# Altium schematic sheet Temperature.SchDoc
size B
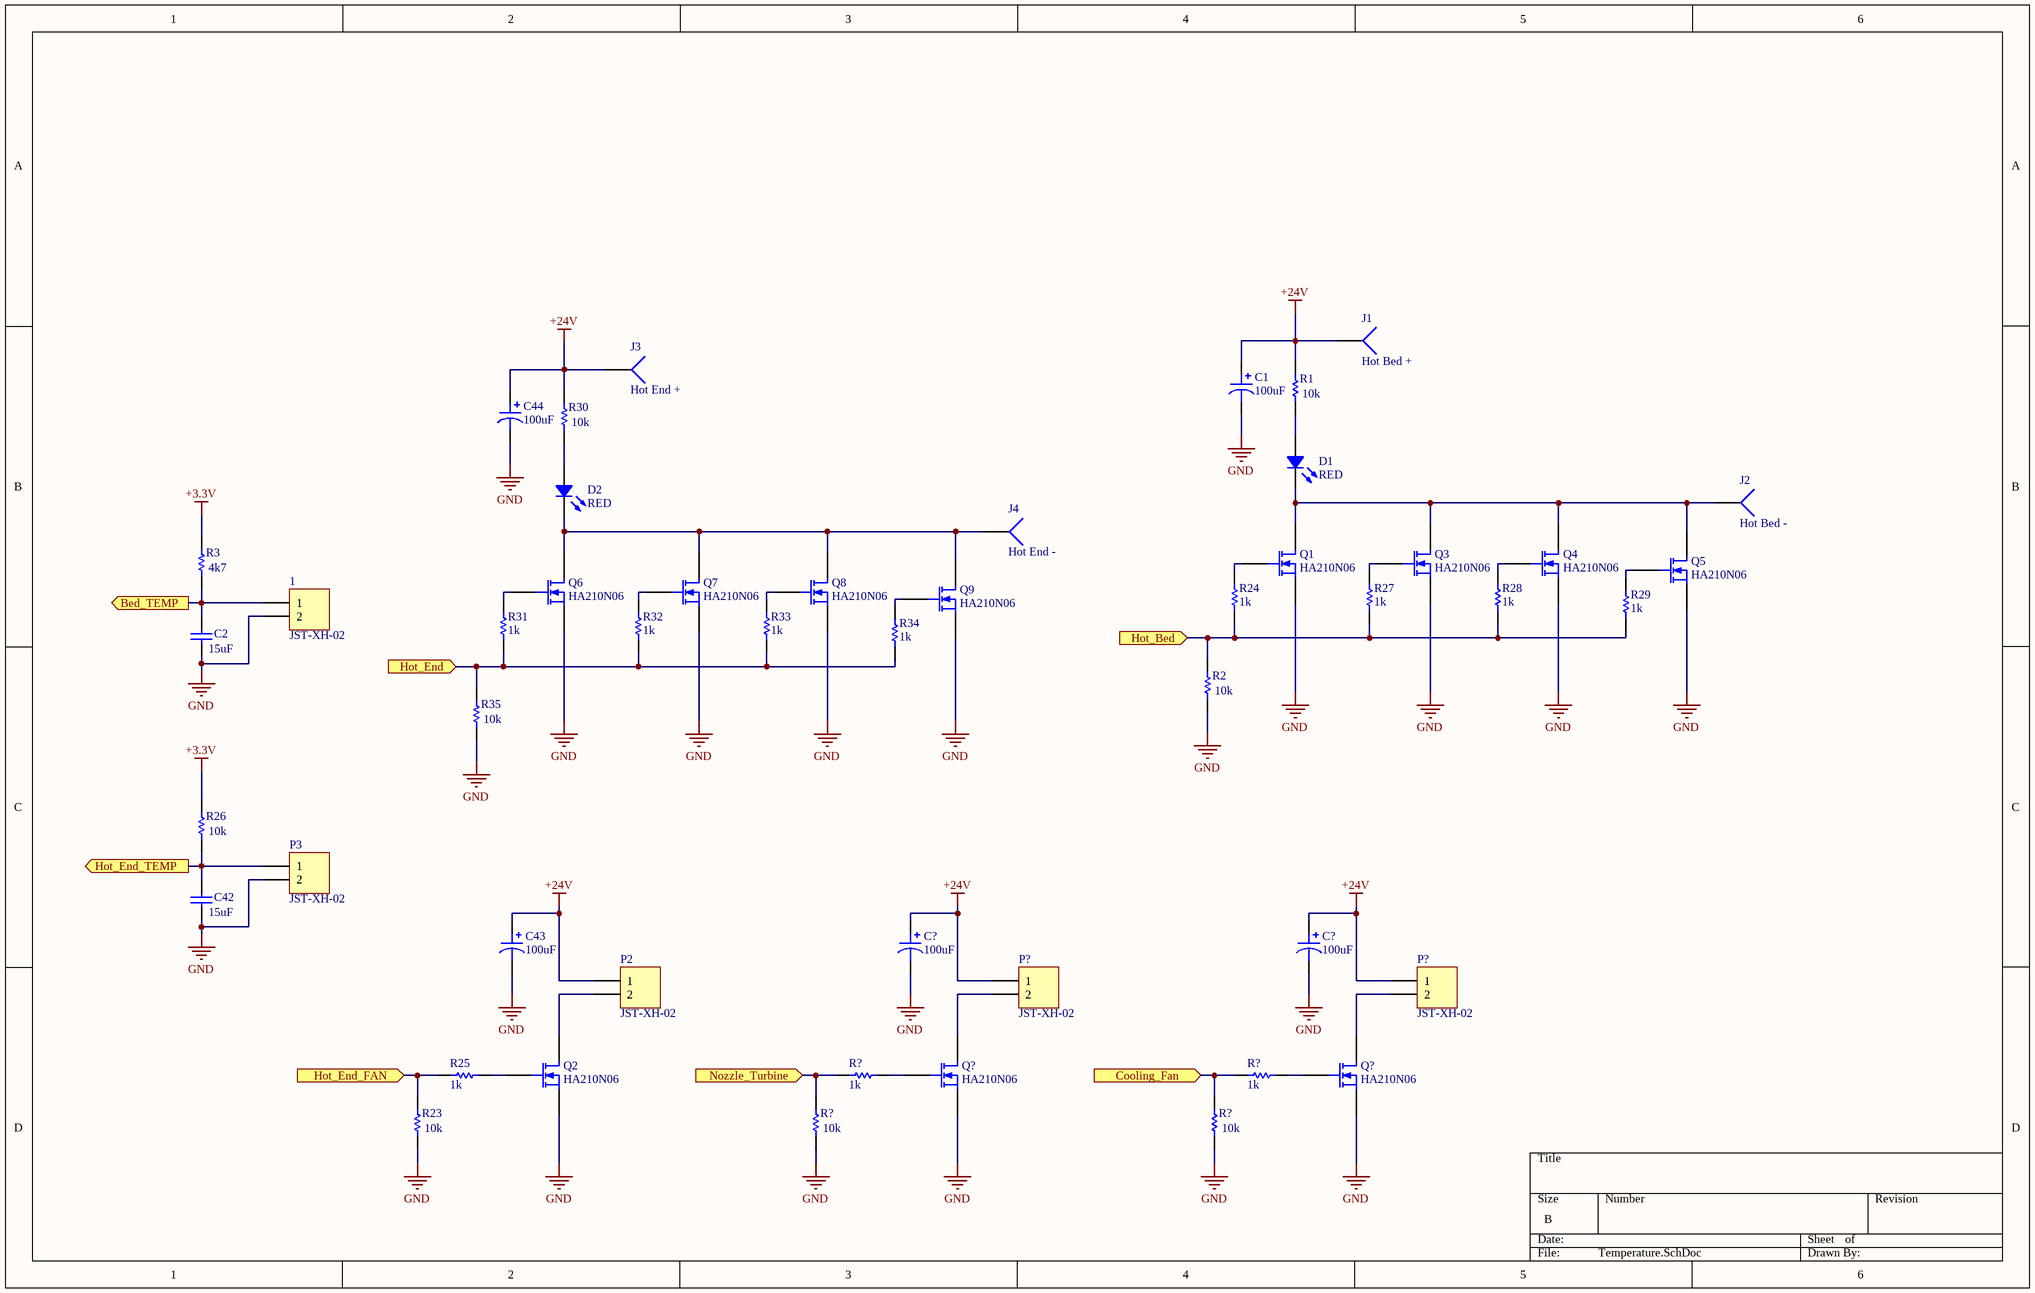
[diagram p0: Temperature.SchDoc]

## Parts
(Parts that share a designator on the sheet are numbered #1, #2 ... from top to bottom, then left to right.)
1  JST-XH-02  [HDR1X2]
C1  100uF  [CAP ALSMD 8.3MM H10.5MM]
C2  value 15uF  [RAD-0.3]  (hidden comment: Cap)
C42  value 15uF  [RAD-0.3]  (hidden comment: Cap)
C43  100uF  [CAP ALSMD 8.3MM H10.5MM]
C44  100uF  [CAP ALSMD 8.3MM H10.5MM]
C?#1  100uF  [CAP ALSMD 8.3MM H10.5MM]
C?#2  100uF  [CAP ALSMD 8.3MM H10.5MM]
D1  RED  [Broadcom 4-PLLC 3228]
D2  RED  [Broadcom 4-PLLC 3228]
J1  Hot Bed +  [PIN1]
J2  Hot Bed -  [PIN1]
J3  Hot End +  [PIN1]
J4  Hot End -  [PIN1]
P2  JST-XH-02  [HDR1X2]
P3  JST-XH-02  [HDR1X2]
P?#1  JST-XH-02  [HDR1X2]
P?#2  JST-XH-02  [HDR1X2]
Q1  HA210N06  [E3]
Q2  HA210N06  [E3]
Q3  HA210N06  [E3]
Q4  HA210N06  [E3]
Q5  HA210N06  [E3]
Q6  HA210N06  [E3]
Q7  HA210N06  [E3]
Q8  HA210N06  [E3]
Q9  HA210N06  [E3]
Q?#1  HA210N06  [E3]
Q?#2  HA210N06  [E3]
R1  value 10k  [AXIAL-0.3]  (hidden comment: Res1)
R2  value 10k  [AXIAL-0.3]  (hidden comment: Res1)
R3  value 4k7  [AXIAL-0.3]  (hidden comment: Res1)
R23  value 10k  [AXIAL-0.3]  (hidden comment: Res1)
R24  value 1k  [AXIAL-0.3]  (hidden comment: Res1)
R25  value 1k  [AXIAL-0.3]  (hidden comment: Res1)
R26  value 10k  [AXIAL-0.3]  (hidden comment: Res1)
R27  value 1k  [AXIAL-0.3]  (hidden comment: Res1)
R28  value 1k  [AXIAL-0.3]  (hidden comment: Res1)
R29  value 1k  [AXIAL-0.3]  (hidden comment: Res1)
R30  value 10k  [AXIAL-0.3]  (hidden comment: Res1)
R31  value 1k  [AXIAL-0.3]  (hidden comment: Res1)
R32  value 1k  [AXIAL-0.3]  (hidden comment: Res1)
R33  value 1k  [AXIAL-0.3]  (hidden comment: Res1)
R34  value 1k  [AXIAL-0.3]  (hidden comment: Res1)
R35  value 10k  [AXIAL-0.3]  (hidden comment: Res1)
R?#1  value 1k  [AXIAL-0.3]  (hidden comment: Res1)
R?#2  value 1k  [AXIAL-0.3]  (hidden comment: Res1)
R?#3  value 10k  [AXIAL-0.3]  (hidden comment: Res1)
R?#4  value 10k  [AXIAL-0.3]  (hidden comment: Res1)

## Ports
Bed_TEMP (out), Cooling_Fan (in), Hot_Bed (in), Hot_End (in), Hot_End_FAN (in), Hot_End_TEMP (out), Nozzle_Turbine (in)

## Nets
+3.3V: R3.2 R26.2
+24V: C1.1 C43.1 C44.1 C?#1.1 C?#2.1 J1.1 J3.1 P2.1 P?#1.1 P?#2.1 R1.2 R30.2
GND: 1.2 C1.2 C2.1 C42.1 C43.2 C44.2 C?#1.2 C?#2.2 P3.2 Q1.3(S) Q2.3(S) Q3.3(S) Q4.3(S) Q5.3(S) Q6.3(S) Q7.3(S) Q8.3(S) Q9.3(S) Q?#1.3(S) Q?#2.3(S) R2.1 R23.1 R35.1 R?#3.1 R?#4.1
Bed_TEMP: 1.1 C2.2 R3.1 ; port Bed_TEMP
Cooling_Fan: R?#2.2 R?#4.2 ; port Cooling_Fan
Hot_Bed: R2.2 R24.2 R27.2 R28.2 R29.2 ; port Hot_Bed
Hot_End: R31.2 R32.2 R33.2 R34.2 R35.2 ; port Hot_End
Hot_End_FAN: R23.2 R25.2 ; port Hot_End_FAN
Hot_End_TEMP: C42.2 P3.1 R26.1 ; port Hot_End_TEMP
Nozzle_Turbine: R?#1.2 R?#3.2 ; port Nozzle_Turbine
NetD1_1: D1.1 R1.1
NetD1_2: D1.2 J2.1 Q1.1(D) Q3.1(D) Q4.1(D) Q5.1(D)
NetD2_1: D2.1 R30.1
NetD2_2: D2.2 J4.1 Q6.1(D) Q7.1(D) Q8.1(D) Q9.1(D)
NetP2_2: P2.2 Q2.1(D)
NetP?#1_2: P?#1.2 Q?#1.1(D)
NetP?#2_2: P?#2.2 Q?#2.1(D)
NetQ1_2: Q1.2(G) R24.1
NetQ2_2: Q2.2(G) R25.1
NetQ3_2: Q3.2(G) R27.1
NetQ4_2: Q4.2(G) R28.1
NetQ5_2: Q5.2(G) R29.1
NetQ6_2: Q6.2(G) R31.1
NetQ7_2: Q7.2(G) R32.1
NetQ8_2: Q8.2(G) R33.1
NetQ9_2: Q9.2(G) R34.1
NetQ?#1_2: Q?#1.2(G) R?#1.1
NetQ?#2_2: Q?#2.2(G) R?#2.1

## Library data of the parts
1 P2 P3 P?#1 P?#2 = Header 2: Header, 2-Pin; LatestRevisionDate: 17-Jul-2002; LatestRevisionNote: Re-released for DXP Platform.; Publisher: Altium Limited
C1 C43 C44 C?#1 C?#2 = UUX1V101MNL6GS: CAP ALUM 100UF 20% 35V SMD; manufacturer: Nichicon; Capacitance: 100µF; Lifetime @ Temp.: 2000 Hrs @ 105°C; Polarization: Polar; Ripple Current @ High Frequency: 367.9mA @ 10kHz; Ripple Current @ Low Frequency: 283mA @ 120Hz; Surface Mount Land Size: 0.327" L x 0.327" W (8.30mm x 8.30mm); value: 100µF; Part Number: UUX1V101MNL6GS; Applications: General Purpose; componentlink1description: Datasheet; componentlink1url: http://nichicon-us.com/english/products/pdfs/e-uux.pdf; componentlink2description: DigiKey Link; componentlink2url: http://digikey.com/product-detail/en/nichicon/UUX1V101MNL6GS/493-6276-1-ND/3438789; Device Package: Radial, Can - SMD; Height - Seated (Max): 0.413" (10.50mm); lastupdated: 02.09.2020 01:25:15; Lifecycle Status: Active; Minimum Order: 1; Mounting Type: Surface Mount; Operating Temperature: -55°C ~ 105°C; Package / Case: Radial, Can - SMD; packaging: TapeAndReel; partid: 7565; Part Status: Active; price: 0.19; series: UUX; Size / Dimension: 0.315" Dia (8.00mm); Supplier 1: DigiKey; Supplier Part Number 1: 493-6276-1-ND; Tolerance: ±20%; Voltage - Rated: 35V
C2 C42 = Cap: Capacitor; Published: 8-Jun-2000; LatestRevisionDate: 17-Jul-2002; LatestRevisionNote: Re-released for DXP Platform.; PackageReference: RAD-0.3; Publisher: Altium Limited; PackageDescription: Radial Cap, Thru-Hole; 2 Leads; 0.3 in Pin Spacing
D1 D2 = ASMT-QABD-AEF0E: LED INDICATOR 0.5W AMBER 4PLCC; Manufacturer: Broadcom Limited; Current - Max: 300mA; Current - Test: 150mA; Flux @ Current/Temperature - Test: 16lm (12lm ~ 20lm); Lumens/Watt @ Current - Test: 46 lm/W; Temperature - Test: 25°C; Viewing Angle: 120°; Voltage - Forward (Vf) (Typ): 2.3V; Wavelength: 591nm (583nm ~ 598nm); Part Number: ASMT-QABD-AEF0E; Color: Amber; ComponentLink1Description: Datasheet; ComponentLink1URL: https://docs.broadcom.com/docs/AV02-1841EN; ComponentLink2Description: DigiKey Link; ComponentLink2URL: http://digikey.com/product-detail/en/broadcom-limited/ASMT-QABD-AEF0E/516-2949-1-ND/4240264; Device Package: 4-PLCC; Height - Seated (Max): 0.083" (2.10mm); LastUpdated: 24.04.2020 00:55:47; Lifecycle Status: Active; Minimum Order: 1; Mounting Type: Surface Mount; Package / Case: 4-PLCC; Packaging: TapeAndReel; Part Status: Active; Price: 0.42; Series: -; Size / Dimension: 0.126" L x 0.110" W (3.20mm x 2.80mm); Supplier 1: DigiKey; Supplier Part Number 1: 516-2949-1-ND; Supplier Device Package: 4-PLCC
J1-J4 = Socket: LatestRevisionDate: 17-Jul-2002; LatestRevisionNote: Re-released for DXP Platform.; Publisher: Altium Limited
Q1-Q9 Q?#1 Q?#2 = MOSFET-N: N-Channel MOSFET; Published: 8-Jun-2000; LatestRevisionDate: 17-Jul-2002; LatestRevisionNote: Re-released for DXP Platform.; PackageVersion: 1995/1996; PackageReference: E3; Publisher: Altium Limited; PackageDescription: TO, Flat Index; 3 In-Line, Axial Leads; Body Dia. 4.6mm; Lead Dia. 0.5 mm (max)
R1-R3 R23-R35 R?#1-R?#4 = Res1: Resistor; Published: 8-Jun-2000; LatestRevisionDate: 17-Jul-2002; LatestRevisionNote: Re-released for DXP Platform.; PackageReference: AXIAL-0.3; Publisher: Altium Limited; PackageDescription: Axial Device, Thru-Hole; 2 Leads; 0.3 in Pin Spacing